# EAGLE design pcie_rs485 (EAGLE 7.5.0)
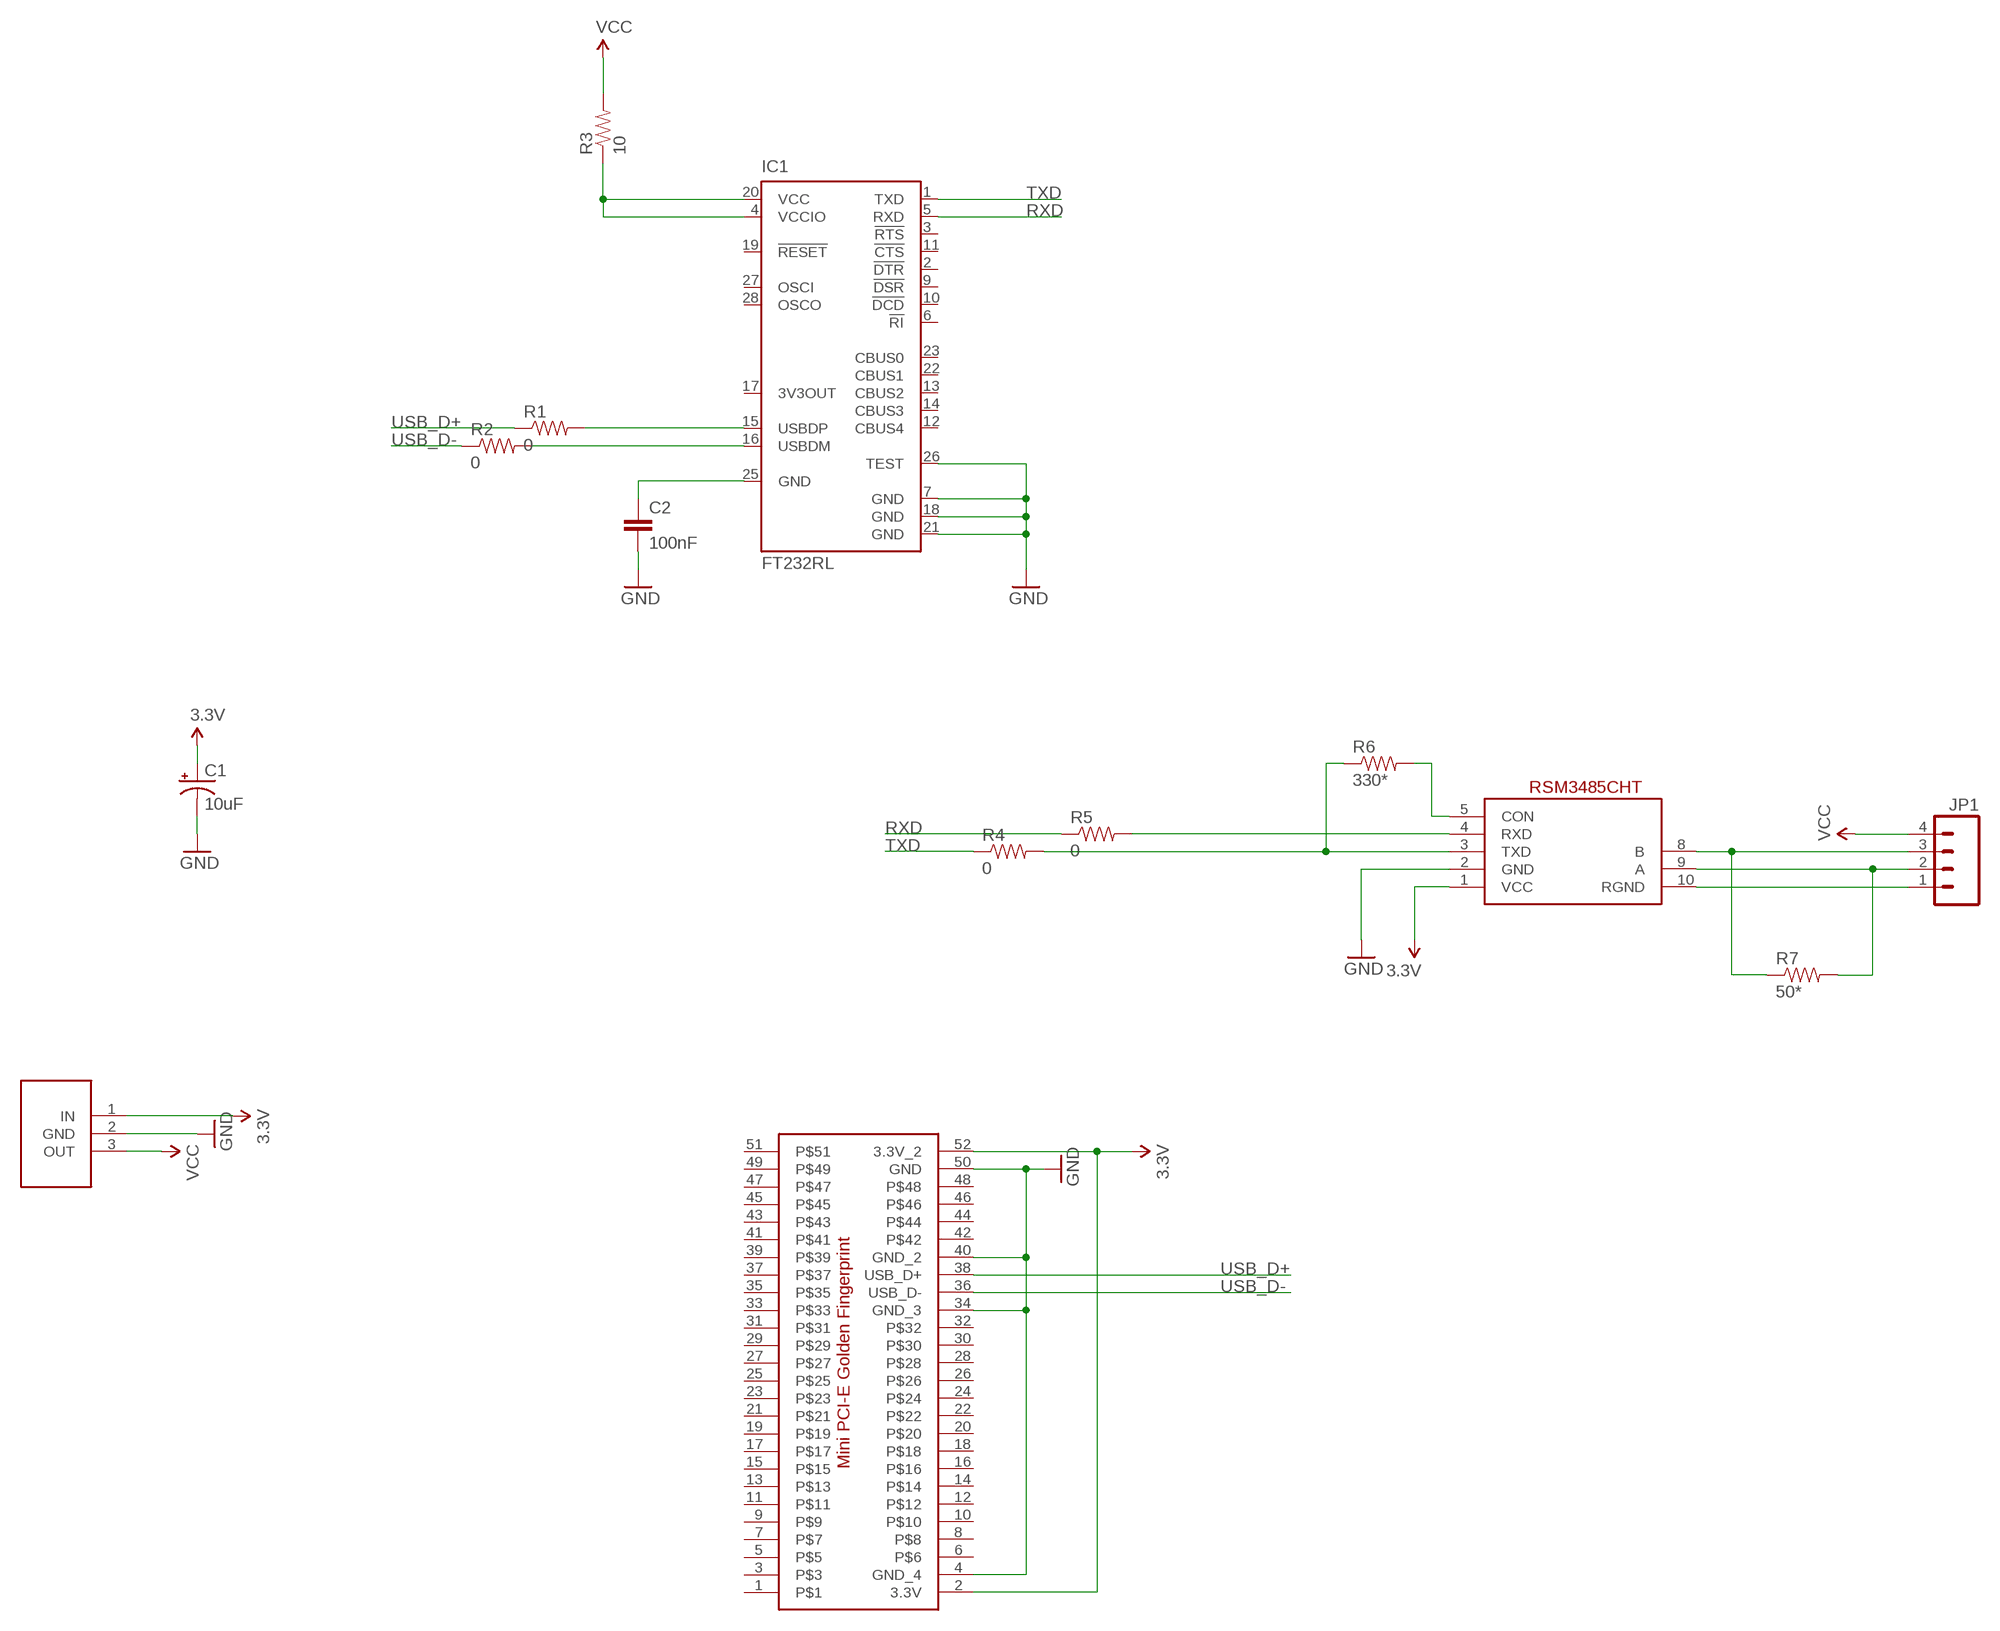
[diagram p0: schematic, sheet 1]

## Parts
C1  10uF  CAP_POL1206  [EIA3216]
C2  100nF  0.1UF-25V(+80/-20%)(0603)  [0603-CAP]
IC1  FT232RL  [SSOP28]
JP1  M04PTH  [1X04]
NC1  RSM3485CHT  [RSM3485CHT]
R1  0  330OHM1/10W1%(0603)  [0603-RES]
R2  0  330OHM1/10W1%(0603)  [0603-RES]
R3  10  330OHM1/10W1%(0603)  [0603-RES]
R4  0  330OHM1/10W1%(0603)  [0603-RES]
R5  0  330OHM1/10W1%(0603)  [0603-RES]
R6  330*  330OHM1/10W1%(0603)  [0603-RES]
R7  50*  330OHM1/10W1%(0603)  [0603-RES]
U1  MINI_PCIE_MODULE  [MINI_PCIE]
U?1  BL8530_M_V5.0  [BL8530_M]

## Nets
3.3V: C1.A(+) NC1.1(VCC) U1.2(3.3V) U1.52(3.3V_2) U?1.1(IN)
GND: C1.C(-) C2.2 IC1.7(GND) IC1.18(GND) IC1.21(GND) IC1.26(TEST) NC1.2(GND) U1.4(GND_4) U1.34(GND_3) U1.40(GND_2) U1.50(GND) U?1.2(GND)
N$1: IC1.15(USBDP) R1.2
N$2: IC1.16(USBDM) R2.2
N$5: C2.1 IC1.25(GND)
N$6: NC1.5(CON) R6.2
RS485_A: JP1.2 NC1.9(A) R7.2
RS485_B: JP1.3 NC1.8(B) R7.1
RS485_RGND: JP1.1 NC1.10(RGND)
RXD: IC1.5(RXD) R5.1
RXD_1: NC1.4(RXD) R5.2
TXD: IC1.1(TXD) R4.1
TXD_1: NC1.3(TXD) R4.2 R6.1
USB_D+: R1.1 U1.38(USB_D+)
USB_D-: R2.1 U1.36(USB_D-)
VCC: JP1.4 R3.2 U?1.3(OUT)
VCC_1: IC1.4(VCCIO) IC1.20(VCC) R3.1
Unconnected: IC1.2(!DTR) IC1.3(!RTS) IC1.6(!RI) IC1.9(!DSR) IC1.10(!DCD) IC1.11(!CTS) IC1.12(CBUS4) IC1.13(CBUS2) IC1.14(CBUS3) IC1.17(3V3OUT) IC1.19(!RESET) IC1.22(CBUS1) IC1.23(CBUS0) IC1.27(OSCI) IC1.28(OSCO) U1.1 U1.3 U1.5 U1.6 U1.7 U1.8 U1.9 U1.10 U1.11 U1.12 U1.13 U1.14 U1.15 U1.16 U1.17 U1.18 U1.19 U1.20 U1.21 U1.22 U1.23 U1.24 U1.25 U1.26 U1.27 U1.28 U1.29 U1.30 U1.31 U1.32 U1.33 U1.35 U1.37 U1.39 U1.41 U1.42 U1.43 U1.44 U1.45 U1.46 U1.47 U1.48 U1.49 U1.51

## Library data of the parts
C1 = SparkFun:CAP_POL: Capacitor Polarized These are standard SMD and PTH capacitors. Normally 10uF, 47uF, and 100uF in electrolytic and tantalum varieties. Always verify the external diameter of the through hole cap, it varies with capacity, voltage, and manufacturer. The EIA devices should be standard.
C2 = SparkFun-Capacitors:0.1UF-25V(+80/-20%)(0603): CAP-00810 Ceramic Standard decoupling cap; PROD_ID: CAP-00810; VALUE: 0.1uF
IC1 = ftdichip:FT232R: Source: http://www.ftdichip.com/Documents/DataSheets/DS_FT232R_v104.pdf; MPN: FT232RL; OC_FARNELL: 1146032; OC_NEWARK: 91K9918
JP1 = SparkFun:M04: Header 4 Standard 4-pin 0.1" header. Use with straight break away headers (SKU : PRT-00116), right angle break away headers (PRT-00553), swiss pins (PRT-00743), machine pins (PRT-00117), and female headers (PRT-00115). Molex polarized connector foot print use with SKU : PRT-08231 with associated crimp pins and housings.
NC1 = iotgw:RSM3485CHT: RSM3485CHT
R1-R7 = SparkFun-Resistors:330OHM1/10W1%(0603): RES-00818; PROD_ID: RES-00818; VALUE: 330
U1 = iotgw:MINI_PCIE_MODULE
U?1 = iotgw:BL8530_M_V5.0

## Board
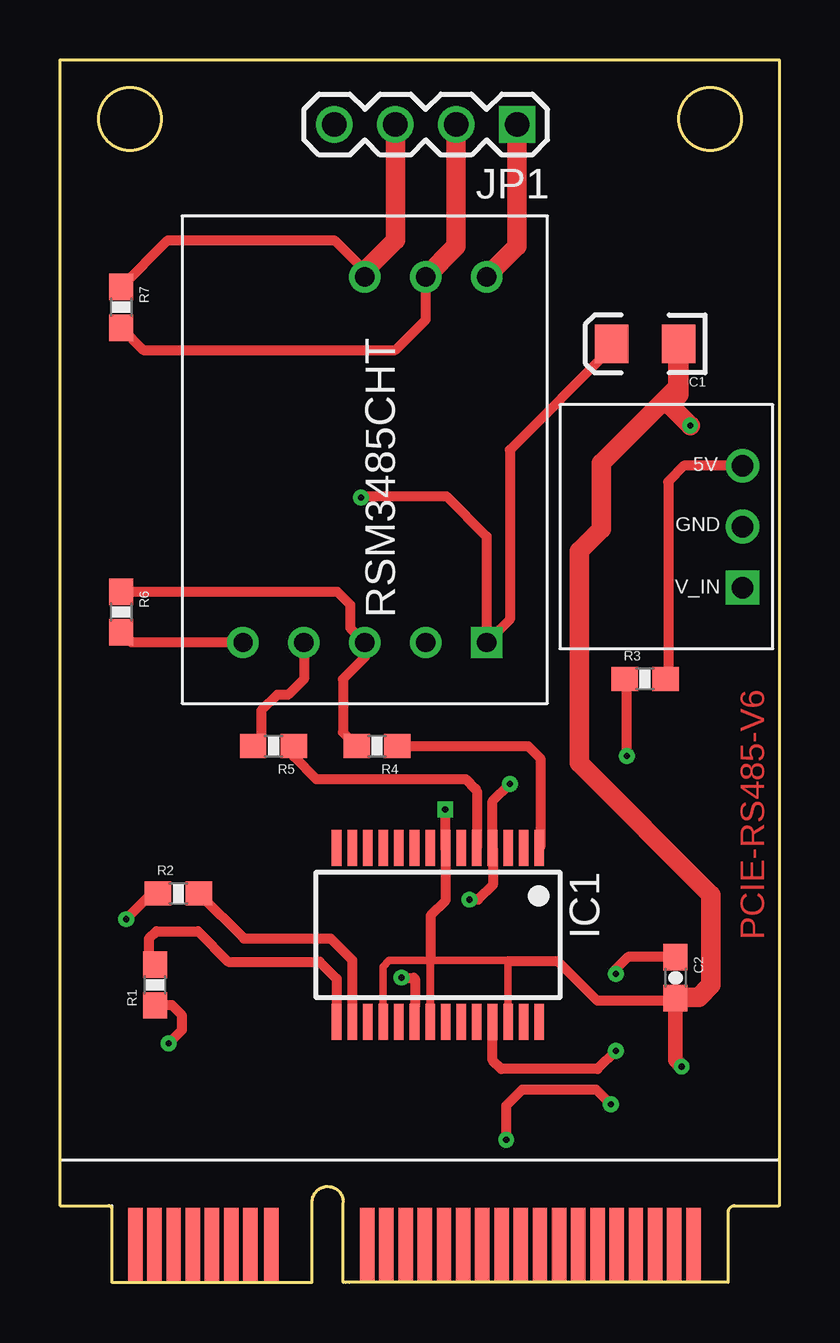
[diagram p1: board, top side]
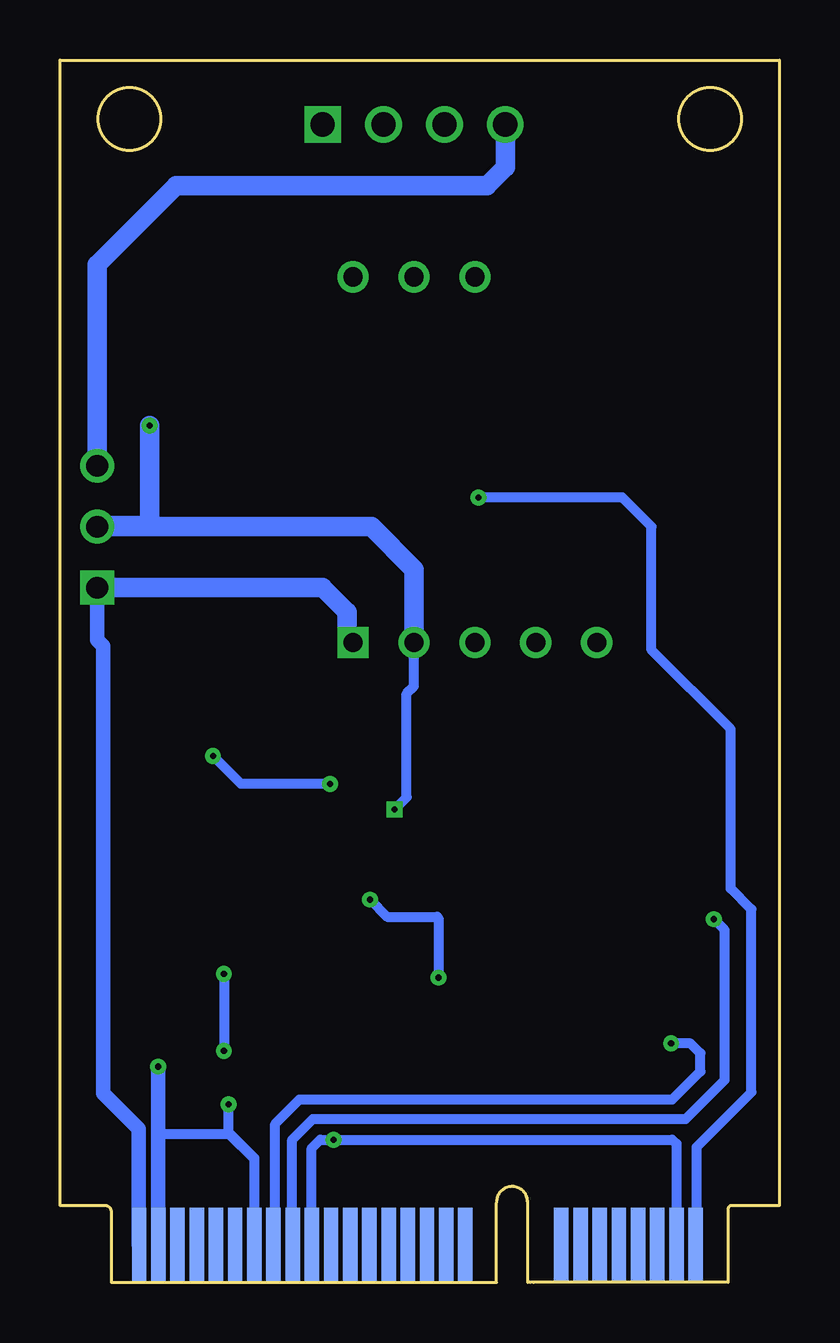
[diagram p2: board, bottom side, seen from below]

Size 30.01 x 50.96 mm. Coordinates in mm from the lower left corner, seen from the top.
Copper layers (1*16): Top 0.035mm / dielectric 1.5mm / Bottom 0.035mm
Design rules "default": minimum track width 10mil, minimum drill 24mil, track to track 8mil, track to pad 8mil, pad to pad 8mil, via to via 8mil, smd to smd 8mil, copper to edge 40mil, drill to drill 8mil, minimum pad ring 10mil, minimum via ring 8mil, stop-mask expansion 4mil, vias tented up to drill 0mil, thermal gap 10mil

### Footprints (pad centres in the part's own frame; a part is rotated, then mirrored left to right if it is on the bottom)
EIA3216 = smd 1.4 x 1.6: A 1.4,0; C -1.4,0
0603-CAP = smd 1.1 x 1: 1 -0.85,0; 2 0.85,0
SSOP28 = smd 0.4 x 1.5: 1 -4.225,-3.625; 2 -3.575,-3.625; 3 -2.925,-3.625; 4 -2.275,-3.625; 5 -1.625,-3.625; 6 -0.975,-3.625; 7 -0.325,-3.625; 8 0.325,-3.625; 9 0.975,-3.625; 10 1.625,-3.625; 11 2.275,-3.625; 12 2.925,-3.625; 13 3.575,-3.625; 14 4.225,-3.625; 15 4.225,3.625; 16 3.575,3.625; 17 2.925,3.625; 18 2.275,3.625; 19 1.625,3.625; 20 0.975,3.625; 21 0.325,3.625; 22 -0.325,3.625; 23 -0.975,3.625; 24 -1.625,3.625; 25 -2.275,3.625; 26 -2.925,3.625; 27 -3.575,3.625; 28 -4.225,3.625
1X04 = drill 1.016 square: 1 0,0 | drill 1.016: 2 2.54,0; 3 5.08,0; 4 7.62,0
RSM3485CHT = drill 0.8 square: 1 -12.7,-10.16 | drill 0.8: 2 -12.7,-7.62; 3 -12.7,-5.08; 4 -12.7,-2.54; 5 -12.7,0; 8 2.54,-5.08; 9 2.54,-7.62; 10 2.54,-10.16
0603-RES = smd 1.1 x 1: 1 -0.85,0; 2 0.85,0
MINI_PCIE = smd 0.6 x 3.1: 1 3.13,1.55; 3 3.93,1.55; 5 4.73,1.55; 7 5.53,1.55; 9 6.33,1.55; 11 7.13,1.55; 13 7.93,1.55; 15 8.8,1.55; 17 12.8,1.55; 19 13.6,1.55; 21 14.4,1.55; 23 15.2,1.55; 25 16,1.55; 27 16.8,1.55; 29 17.6,1.55; 31 18.4,1.55; 33 19.2,1.55; 35 20,1.55; 37 20.8,1.55; 39 21.6,1.55; 41 22.4,1.55; 43 23.2,1.55; 45 24,1.55; 47 24.8,1.55; 49 25.6,1.55; 51 26.4,1.55 | smd 0.6 x 3.1 bottom: 2 3.5,1.55; 4 4.3,1.55; 6 5.1,1.55; 8 5.9,1.55; 10 6.7,1.55; 12 7.5,1.55; 14 8.3,1.55; 16 9.1,1.55; 18 13.1,1.55; 20 13.9,1.55; 22 14.7,1.55; 24 15.5,1.55; 26 16.3,1.55; 28 17.1,1.55; 30 17.9,1.55; 32 18.7,1.55; 34 19.5,1.55; 36 20.3,1.55; 38 21.1,1.55; 40 21.9,1.55; 42 22.7,1.55; 44 23.5,1.55; 46 24.3,1.55; 48 25.1,1.55; 50 25.9,1.55; 52 26.7,1.55
BL8530_M = drill 0.9 square: 1 2.54,1.27 | drill 0.9: 2 5.08,1.27; 3 7.62,1.27

### Placement (x,y rotation side)
C1  24.39,39.13 180 top
C2  25.66,12.71 270 top
IC1  15.76,14.49 180 top
JP1  19.06,48.27 180 top
NC1  7.63,39.38 90 top
R1  3.97,12.41 90 top
R2  4.94,16.22 0 top
R3  24.39,25.16 0 top
R4  13.22,22.36 180 top
R5  8.9,22.36 180 top
R6  2.55,27.95 270 top
R7  2.55,40.65 270 top
U1  0.01,0.01 0 top
U?1  29.73,26.43 90 top

### Tracks (layer width: path | path; a pad name or v marks a point on that pad's centre or on a via)
3.3V  (via drill 0.25)
  Top 0.406: C1.A 22.99,38.95 18.76,34.71 18.76,27.65 NC1.1 | 17.79,27.49 NC1.1 | v12.56,32.73 12.61,32.78 16.11,32.78 17.79,31.1 NC1.1
  Bottom 0.406: U1.2 3.46,1.61 3.46,5.65 1.18,7.94 1.18,15.55 2.04,16.42 2.04,23.07 5.34,26.38 5.34,31.51 6.56,32.73 v12.56,32.73
  Bottom 0.61: U1.52 26.73,1.58 26.73,6.41 28.2,7.88 28.2,26.53 28.46,26.78 U?1.1
  Bottom 0.813: U?1.1 19.06,28.97 18.04,27.95 18.04,26.93 NC1.1
GND  (via drill 0.25)
  Top 0.305: IC1.18 13.47,10.98 13.47,13.17 13.73,13.42 15.4,13.42 15.43,13.39 IC1.21 15.45,10.88 15.45,13.42 18.65,13.42 18.68,13.39 IC1.26
  Top 0.406: 15.45,13.42 15.45,15.3 16.06,15.91 16.06,18.09 IC1.7 16.06,18.13 v16.06,19.72 | C2.2 25.55,11.75 22.41,11.75 20.77,13.39 18.68,13.39 | v22.97,7.43 22.36,8.04 19.26,8.04 18.6,7.38 v18.6,5.95
  Top 0.61: v25.92,9 25.66,9.26 C2.2
  Top 0.813: v26.27,35.72 25.41,36.59 25.36,36.59 25.79,37.02 C1.C
  Bottom 0.406: v16.06,19.72 15.55,20.23 15.55,24.55 15.25,24.85 NC1.2 | U1.50 25.87,1.6 25.87,6.21 22.92,6.21 21.91,5.2 U1.40 21.9,5.14 22.97,6.21 v22.97,7.43 | U1.34 19.52,5.6 19.16,5.95 v18.6,5.95 4.48,5.95 4.31,5.78 U1.4
  Bottom 0.61: U1.50 v25.92,9
  Bottom 0.813: NC1.2 15.25,29.73 17.03,31.51 U?1.2 28.41,31.56 26.48,31.56 26.27,31.76 v26.27,35.72
N$1
  Top 0.406: R1.2 3.72,13.51 3.72,14.34 4.02,14.64 5.75,14.64 7.02,13.37 10.83,13.37 11.53,12.67 IC1.15
N$2
  Top 0.406: R2.2 7.67,14.34 11.29,14.34 12.18,13.44 IC1.16
N$3
  Top 0.813: 12.71,42.17 13.98,43.44 13.98,48.52
N$4
  Top 0.813: 25.71,11.9 26.63,11.9 27.14,12.41 27.14,16.16 21.65,21.65 21.65,30.49 22.57,31.4 22.57,34.15 25.77,37.35 25.77,38.97
N$5  (via drill 0.25)
  Top 0.406: C2.1 25.65,13.57 23.68,13.57 23.18,13.07 v23.18,12.86 | v23.18,9.66 22.41,8.9 18.4,8.9 18.03,9.27 IC1.25
  Bottom 0.406: v23.18,12.86 v23.18,9.66
N$6
  Top 0.406: NC1.5 2.97,26.68 R6.2
RS485_A
  Top 0.406: R7.2 3.48,38.87 13.98,38.87 15.25,40.14 NC1.9
  Top 0.813: NC1.9 16.52,43.19 JP1.2
RS485_B
  Top 0.406: R7.1 4.49,43.44 11.44,43.44 12.71,42.17 NC1.8 13.98,43.19 JP1.3
RS485_RGND
  Top 0.813: NC1.10 19.06,43.19 JP1.1
RXD
  Top 0.406: R5.1 9.75,21.92 10.68,20.99 16.93,20.99 17.33,20.58 17.33,20.53 17.38,20.48 IC1.5
RXD_1
  Top 0.406: NC1.4 10.17,25.16 9.51,24.5 9.05,24.5 8.39,23.84 8.39,22.7 R5.2
TXD
  Top 0.406: R4.1 19.52,22.36 20.02,21.85 20.02,18.16 IC1.1
TXD_1
  Top 0.406: R6.1 11.55,28.8 12.1,28.26 12.1,27.29 NC1.3 12.71,26.07 11.8,25.16 11.8,22.93 R4.2
USB_D+  (via drill 0.25)
  Top 0.406: v4.53,9.97 5.09,10.53 5.09,11.13 4.67,11.55 R1.1
  Bottom 0.406: U1.38 21.04,1.63 21.04,6.61 20.02,7.63 4.48,7.63 3.31,8.8 3.31,9.56 3.72,9.97 v4.53,9.97
USB_D-  (via drill 0.25)
  Top 0.406: v2.75,15.15 3.82,16.21 R2.1
  Bottom 0.406: U1.36 20.33,1.58 20.33,5.95 19.47,6.82 3.92,6.82 2.3,8.44 2.3,14.69 v2.75,15.15
VCC
  Top 0.406: U?1.3 26.02,34.05 25.36,33.39 25.36,25.27 R3.2
  Bottom 0.813: JP1.4 11.44,46.49 12.2,45.73 25.16,45.73 28.46,42.43 U?1.3
VCC_1  (via drill 0.25)
  Top 0.305: 14.79,11.49 14.78,11.48 IC1.20
  Top 0.406: v18.76,20.79 18.03,20.07 IC1.4 18.04,18.1 18.04,16.57 17.43,15.96 v17.08,15.96 | v23.63,21.96 23.63,25.07 R3.1 | v14.23,12.71 14.74,12.71 14.79,12.66 14.79,11.49
  Bottom 0.406: v18.76,20.79 22.46,20.79 v23.63,21.96 | v17.08,15.96 16.37,15.25 14.29,15.25 14.23,15.2 v14.23,12.71

### Text on the board
Top: PCIE-RS485-V6